# EAGLE schematic NIBB (EAGLE 8.1.0)
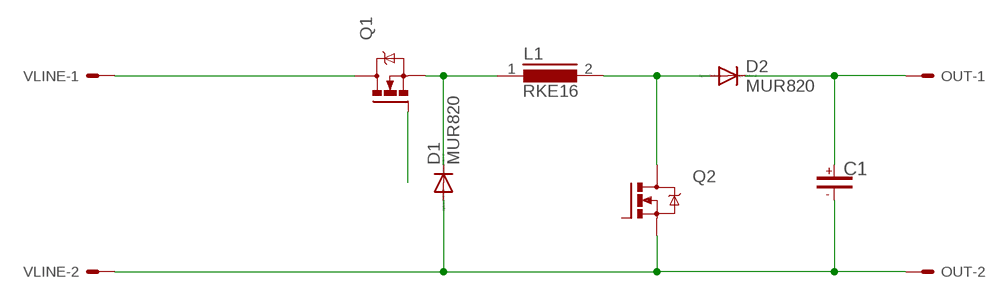
[diagram p0: schematic, sheet 1]

## Parts
C1  CAPP-UF  [20ROUND40P]
D1  MUR820  [C221B1A]
D2  MUR820  [C221B1A]
L1  RKE16  [RKE16]
OUT  22-23-2021  [22-23-2021]
Q1  IRF640  [TO220BV]
Q2  IRF640  [TO220BV]
VLINE  22-23-2021  [22-23-2021]

## Nets
N$1: D1.C L1.1 Q1.S
N$2: D2.A L1.2 Q2.D
N$3: Q1.D VLINE.1
N$4: C1.- D1.A OUT.2 Q2.S VLINE.2
N$5: Q1.G
N$7: C1.+ D2.C OUT.1
Unconnected: Q2.G

## Library data of the parts
C1 = capacitor:CAPP-U: Polarized capacitor, positive up; DESC: Capacitor, polarized
D1 D2 = diode:MUR820: DIODE
L1 = inductors:RKE16: INDUCTOR
OUT VLINE = con-molex:22-23-2021: .100" (2.54mm) Center Header - 2 Pin; MF: MOLEX; MPN: 22-23-2021; OC_FARNELL: 1462926; OC_NEWARK: 25C3832
Q1 Q2 = felippe:IRF640